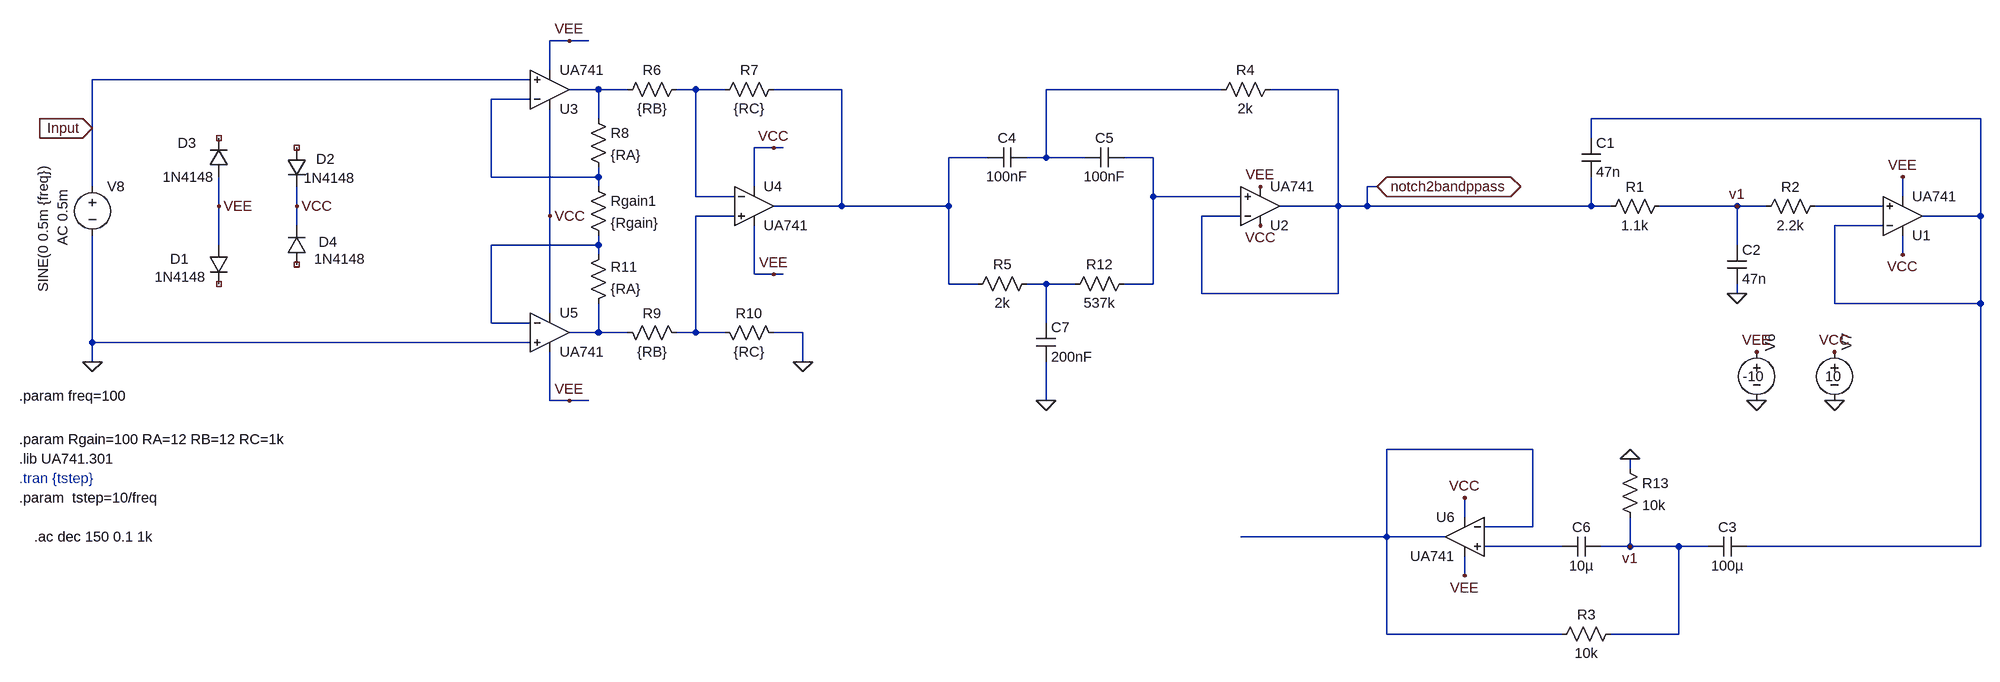
[diagram p0: schematic circuit.asc]
circuit.asc, the LTspice schematic file:
Version 4.1
SHEET 1 3996 680
WIRE 1408 -1088 1376 -1088
WIRE 1440 -1088 1408 -1088
WIRE 1376 -1040 1376 -1088
WIRE 1344 -1024 624 -1024
WIRE 1456 -1008 1408 -1008
WIRE 1504 -1008 1456 -1008
WIRE 1616 -1008 1584 -1008
WIRE 1664 -1008 1616 -1008
WIRE 1856 -1008 1744 -1008
WIRE 2480 -1008 2192 -1008
WIRE 2672 -1008 2560 -1008
WIRE 1344 -992 1280 -992
WIRE 1456 -960 1456 -1008
WIRE 3728 -960 3088 -960
WIRE 624 -944 624 -1024
WIRE 3088 -928 3088 -960
WIRE 1744 -912 1712 -912
WIRE 1760 -912 1744 -912
WIRE 2096 -896 2032 -896
WIRE 2192 -896 2192 -1008
WIRE 2192 -896 2160 -896
WIRE 2256 -896 2192 -896
WIRE 2368 -896 2320 -896
WIRE 1280 -864 1280 -992
WIRE 1456 -864 1456 -880
WIRE 1456 -864 1280 -864
WIRE 624 -848 624 -944
WIRE 1456 -848 1456 -864
WIRE 1712 -848 1712 -912
WIRE 2736 -848 2720 -848
WIRE 1616 -832 1616 -1008
WIRE 1680 -832 1616 -832
WIRE 2368 -832 2368 -896
WIRE 2512 -832 2368 -832
WIRE 3600 -832 3600 -864
WIRE 832 -816 832 -864
WIRE 960 -816 960 -848
WIRE 1856 -816 1856 -1008
WIRE 1856 -816 1744 -816
WIRE 2032 -816 2032 -896
WIRE 2032 -816 1856 -816
WIRE 2672 -816 2672 -1008
WIRE 2672 -816 2576 -816
WIRE 2720 -816 2720 -848
WIRE 2720 -816 2672 -816
WIRE 3088 -816 3088 -864
WIRE 3088 -816 2720 -816
WIRE 3120 -816 3088 -816
WIRE 3328 -816 3200 -816
WIRE 3376 -816 3328 -816
WIRE 3568 -816 3456 -816
WIRE 1376 -800 1376 -976
WIRE 1680 -800 1616 -800
WIRE 2512 -800 2448 -800
WIRE 3728 -800 3728 -960
WIRE 3728 -800 3632 -800
WIRE 960 -784 960 -816
WIRE 3568 -784 3488 -784
WIRE 832 -752 832 -816
WIRE 1456 -752 1456 -768
WIRE 1456 -752 1280 -752
WIRE 3328 -752 3328 -816
WIRE 1456 -736 1456 -752
WIRE 3600 -736 3600 -768
WIRE 1712 -704 1712 -784
WIRE 1744 -704 1712 -704
WIRE 1760 -704 1744 -704
WIRE 2032 -688 2032 -816
WIRE 2080 -688 2032 -688
WIRE 2192 -688 2160 -688
WIRE 2240 -688 2192 -688
WIRE 2368 -688 2368 -832
WIRE 2368 -688 2320 -688
WIRE 2448 -672 2448 -800
WIRE 2672 -672 2672 -816
WIRE 2672 -672 2448 -672
WIRE 3328 -672 3328 -688
WIRE 3488 -656 3488 -784
WIRE 3728 -656 3728 -800
WIRE 3728 -656 3488 -656
WIRE 1376 -640 1376 -800
WIRE 1280 -624 1280 -752
WIRE 1344 -624 1280 -624
WIRE 2192 -624 2192 -688
WIRE 1456 -608 1456 -656
WIRE 1456 -608 1408 -608
WIRE 1504 -608 1456 -608
WIRE 1616 -608 1616 -800
WIRE 1616 -608 1584 -608
WIRE 1664 -608 1616 -608
WIRE 1792 -608 1744 -608
WIRE 624 -592 624 -768
WIRE 1344 -592 624 -592
WIRE 624 -560 624 -592
WIRE 1792 -560 1792 -608
WIRE 1376 -496 1376 -576
WIRE 1408 -496 1376 -496
WIRE 1440 -496 1408 -496
WIRE 2192 -496 2192 -560
WIRE 2992 -416 2752 -416
WIRE 3152 -384 3152 -400
WIRE 2880 -304 2880 -336
WIRE 2992 -288 2992 -416
WIRE 2992 -288 2912 -288
WIRE 2752 -272 2752 -416
WIRE 2752 -272 2512 -272
WIRE 2848 -272 2752 -272
WIRE 3040 -256 2912 -256
WIRE 3152 -256 3152 -304
WIRE 3152 -256 3104 -256
WIRE 3232 -256 3152 -256
WIRE 3280 -256 3232 -256
WIRE 3728 -256 3728 -656
WIRE 3728 -256 3344 -256
WIRE 2880 -208 2880 -240
WIRE 2752 -112 2752 -272
WIRE 3040 -112 2752 -112
WIRE 3232 -112 3232 -256
WIRE 3232 -112 3120 -112
FLAG 1792 -560 0
FLAG 3360 -496 0
FLAG 3488 -496 0
FLAG 3488 -576 VCC
FLAG 1376 -800 VCC
FLAG 1744 -912 VCC
FLAG 3360 -576 VEE
FLAG 1744 -704 VEE
FLAG 1408 -1088 VEE
FLAG 1408 -496 VEE
FLAG 624 -560 0
FLAG 624 -944 Input
IOPIN 624 -944 In
FLAG 3328 -816 v1
FLAG 3328 -672 0
FLAG 3600 -736 VCC
FLAG 3600 -864 VEE
FLAG 832 -816 VEE
FLAG 960 -816 VCC
FLAG 3152 -256 v1
FLAG 3152 -400 0
FLAG 2192 -496 0
FLAG 2544 -848 VEE
FLAG 2544 -784 VCC
FLAG 2736 -848 notch2bandppass
IOPIN 2736 -848 BiDir
FLAG 2880 -336 VCC
FLAG 2880 -208 VEE
SYMBOL OpAmps\\opamp2 1376 -944 M180
SYMATTR InstName U3
SYMATTR Value UA741
SYMBOL res 1600 -1024 R90
WINDOW 0 0 56 VBottom 2
WINDOW 3 32 56 VTop 2
SYMATTR InstName R6
SYMATTR Value {RB}
SYMBOL res 1760 -1024 R90
WINDOW 0 0 56 VBottom 2
WINDOW 3 32 56 VTop 2
SYMATTR InstName R7
SYMATTR Value {RC}
SYMBOL res 1440 -976 R0
SYMATTR InstName R8
SYMATTR Value {RA}
SYMBOL res 1440 -864 R0
SYMATTR InstName Rgain1
SYMATTR Value {Rgain}
SYMBOL OpAmps\\opamp2 1712 -880 R0
SYMATTR InstName U4
SYMATTR Value UA741
SYMBOL OpAmps\\opamp2 1376 -672 R0
SYMATTR InstName U5
SYMATTR Value UA741
SYMBOL res 1600 -592 M270
WINDOW 0 32 56 VTop 2
WINDOW 3 0 56 VBottom 2
SYMATTR InstName R9
SYMATTR Value {RB}
SYMBOL res 1760 -592 M270
WINDOW 0 32 56 VTop 2
WINDOW 3 0 56 VBottom 2
SYMATTR InstName R10
SYMATTR Value {RC}
SYMBOL res 1440 -640 M180
WINDOW 0 36 76 Left 2
WINDOW 3 36 40 Left 2
SYMATTR InstName R11
SYMATTR Value {RA}
SYMBOL voltage 3360 -592 R0
WINDOW 0 23 -14 VRight 2
WINDOW 3 -23 56 Left 2
WINDOW 123 0 0 Left 0
WINDOW 39 0 0 Left 0
SYMATTR InstName V6
SYMATTR Value -10
SYMBOL voltage 3488 -592 R0
WINDOW 0 21 -15 VRight 2
WINDOW 3 -15 56 Left 2
WINDOW 123 0 0 Left 0
WINDOW 39 0 0 Left 0
SYMATTR InstName V7
SYMATTR Value 10
SYMBOL voltage 624 -864 R0
WINDOW 3 -80 -22 VRight 2
WINDOW 123 -48 19 VRight 2
WINDOW 39 0 0 Left 0
SYMATTR Value SINE(0 0.5m {freq})
SYMATTR Value2 AC 0.5m
SYMATTR InstName V8
SYMBOL res 3216 -832 R90
WINDOW 0 0 56 VBottom 2
WINDOW 3 32 56 VTop 2
SYMATTR InstName R1
SYMATTR Value 1.1k
SYMBOL res 3472 -832 R90
WINDOW 0 0 56 VBottom 2
WINDOW 3 32 56 VTop 2
SYMATTR InstName R2
SYMATTR Value 2.2k
SYMBOL cap 3072 -928 R0
SYMATTR InstName C1
SYMATTR Value 47n
SYMBOL cap 3312 -752 R0
SYMATTR InstName C2
SYMATTR Value 47n
SYMBOL OpAmps\\opamp2 3600 -736 M180
SYMATTR InstName U1
SYMATTR Value UA741
SYMBOL diode 816 -752 R0
WINDOW 0 -64 23 Left 2
WINDOW 3 -90 53 Left 2
SYMATTR InstName D1
SYMATTR Value 1N4148
SYMBOL diode 944 -912 R0
WINDOW 0 48 19 Left 2
WINDOW 3 27 50 Left 2
SYMATTR InstName D2
SYMATTR Value 1N4148
SYMBOL diode 848 -864 R180
WINDOW 0 53 56 Left 2
WINDOW 3 24 0 Left 2
SYMATTR InstName D3
SYMATTR Value 1N4148
SYMBOL diode 976 -720 R180
WINDOW 0 -51 37 Left 2
WINDOW 3 -97 9 Left 2
SYMATTR InstName D4
SYMATTR Value 1N4148
SYMBOL cap 3280 -240 R270
WINDOW 0 32 32 VTop 2
WINDOW 3 0 32 VBottom 2
SYMATTR InstName C3
SYMATTR Value 100µ
SYMBOL cap 3040 -240 R270
WINDOW 0 32 32 VTop 2
WINDOW 3 0 32 VBottom 2
SYMATTR InstName C6
SYMATTR Value 10µ
SYMBOL res 3136 -128 R90
WINDOW 0 0 56 VBottom 2
WINDOW 3 32 56 VTop 2
SYMATTR InstName R3
SYMATTR Value 10k
SYMBOL res 3136 -400 R0
SYMATTR InstName R13
SYMATTR Value 10k
SYMBOL OpAmps\\opamp2 2544 -752 M180
SYMATTR InstName U2
SYMATTR Value UA741
SYMBOL res 2576 -1024 R90
WINDOW 0 0 56 VBottom 2
WINDOW 3 32 56 VTop 2
SYMATTR InstName R4
SYMATTR Value 2k
SYMBOL cap 2160 -912 R90
WINDOW 0 0 32 VBottom 2
WINDOW 3 32 32 VTop 2
SYMATTR InstName C4
SYMATTR Value 100nF
SYMBOL cap 2320 -912 R90
WINDOW 0 0 32 VBottom 2
WINDOW 3 32 32 VTop 2
SYMATTR InstName C5
SYMATTR Value 100nF
SYMBOL res 2176 -704 R90
WINDOW 0 0 56 VBottom 2
WINDOW 3 32 56 VTop 2
SYMATTR InstName R5
SYMATTR Value 2k
SYMBOL res 2336 -704 R90
WINDOW 0 0 56 VBottom 2
WINDOW 3 32 56 VTop 2
SYMATTR InstName R12
SYMATTR Value 537k
SYMBOL cap 2176 -624 R0
SYMATTR InstName C7
SYMATTR Value 200nF
SYMBOL OpAmps\\opamp2 2880 -336 M0
SYMATTR InstName U6
SYMATTR Value UA741
TEXT 504 -400 Left 2 !.lib UA741.301
TEXT 504 -432 Left 2 !.param Rgain=100 RA=12 RB=12 RC=1k
TEXT 504 -368 Left 2 ;.tran {tstep}
TEXT 504 -504 Left 2 !.param freq=100
TEXT 504 -336 Left 2 !.param  tstep=10/freq
TEXT 528 -272 Left 2 !.ac dec 150 0.1 1k

The netlist it stands for:
* circuit.asc
X§U3 Input N005 VCC VEE N001 UA741  ; pins In+ In- V+ V- OUT
R6 N002 N001 {RB}
R7 N003 N002 {RC}
R8 N001 N005 {RA}
Rgain1 N005 N010 {Rgain}
X§U4 N009 N002 VCC VEE N003 UA741  ; pins In+ In- V+ V- OUT
X§U5 0 N010 VCC VEE N012 UA741  ; pins In+ In- V+ V- OUT
R9 N009 N012 {RB}
R10 0 N009 {RC}
R11 N012 N010 {RA}
V6 VEE 0 -10
V7 VCC 0 10
V8 Input 0 SINE(0 0.5m {freq}) AC 0.5m
R1 v1 notch2bandppass 1.1k
R2 N008 v1 2.2k
C1 N006 notch2bandppass 47n
C2 v1 0 47n
X§U1 N008 N006 VCC VEE N006 UA741  ; pins In+ In- V+ V- OUT
D1 VEE NC_01 1N4148
D2 NC_02 VCC 1N4148
D3 VEE NC_03 1N4148
D4 NC_04 VCC 1N4148
C3 v1 N006 100µ
C6 N014 v1 10µ
R3 v1 N013 10k
R13 0 v1 10k
X§U2 N007 notch2bandppass VCC VEE notch2bandppass UA741  ; pins In+ In- V+ V- OUT
R4 notch2bandppass N004 2k
C4 N004 N003 100nF
C5 N007 N004 100nF
R5 N011 N003 2k
R12 N007 N011 537k
C7 N011 0 200nF
X§U6 N014 N013 VCC VEE N013 UA741  ; pins In+ In- V+ V- OUT
.model D D
.lib standard.dio
.lib UA741.301
.param Rgain=100 RA=12 RB=12 RC=1k
* .tran {tstep}
.param freq=100
.param  tstep=10/freq
.ac dec 150 0.1 1k
.backanno
.end